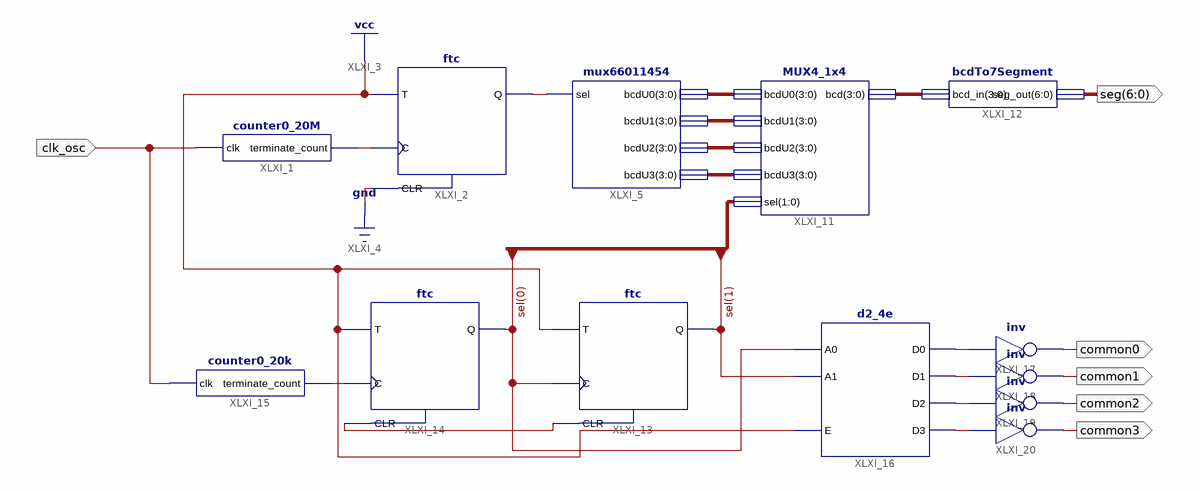
[diagram p0: schematic sheet 1]
// Xilinx ISE schematic top.sch (spartan6) as structural Verilog: 13 symbols, 6 ports
module top (
  input  clk_osc,
  output [6:0] seg,
  output common0,
  output common1,
  output common2,
  output common3
);

  wire XLXN_1, XLXN_6, XLXN_21, XLXN_25, XLXN_40, XLXN_41, XLXN_42, XLXN_43;
  wire [1:0] sel;
  wire [3:0] XLXN_12, XLXN_13, XLXN_14, XLXN_15, XLXN_16;

  counter0_20M XLXI_1 (.clk(clk_osc), .terminate_count(XLXN_1));
  ftc XLXI_2 (.C(XLXN_1), .CLR(1'b0), .T(1'b1), .Q(XLXN_6));
  mux66011454 XLXI_5 (.sel(XLXN_6), .bcdU0(XLXN_12), .bcdU1(XLXN_13), .bcdU2(XLXN_14), .bcdU3(XLXN_15));
  MUX4_1x4 XLXI_11 (.bcdU0(XLXN_12), .bcdU1(XLXN_13), .bcdU2(XLXN_14), .bcdU3(XLXN_15), .sel(sel), .bcd(XLXN_16));
  bcdTo7Segment XLXI_12 (.bcd_in(XLXN_16), .seg_out(seg));
  ftc XLXI_13 (.C(sel[0]), .CLR(XLXN_21), .T(1'b1), .Q(sel[1]));
  ftc XLXI_14 (.C(XLXN_25), .CLR(XLXN_21), .T(1'b1), .Q(sel[0]));
  counter0_20k XLXI_15 (.clk(clk_osc), .terminate_count(XLXN_25));
  d2_4e XLXI_16 (.A0(sel[0]), .A1(sel[1]), .E(1'b1), .D0(XLXN_40), .D1(XLXN_41), .D2(XLXN_42), .D3(XLXN_43));
  not XLXI_17 (common0, XLXN_40);
  not XLXI_18 (common1, XLXN_41);
  not XLXI_19 (common2, XLXN_42);
  not XLXI_20 (common3, XLXN_43);
endmodule
